# EAGLE design en76-timbremod (EAGLE 6.6.0)
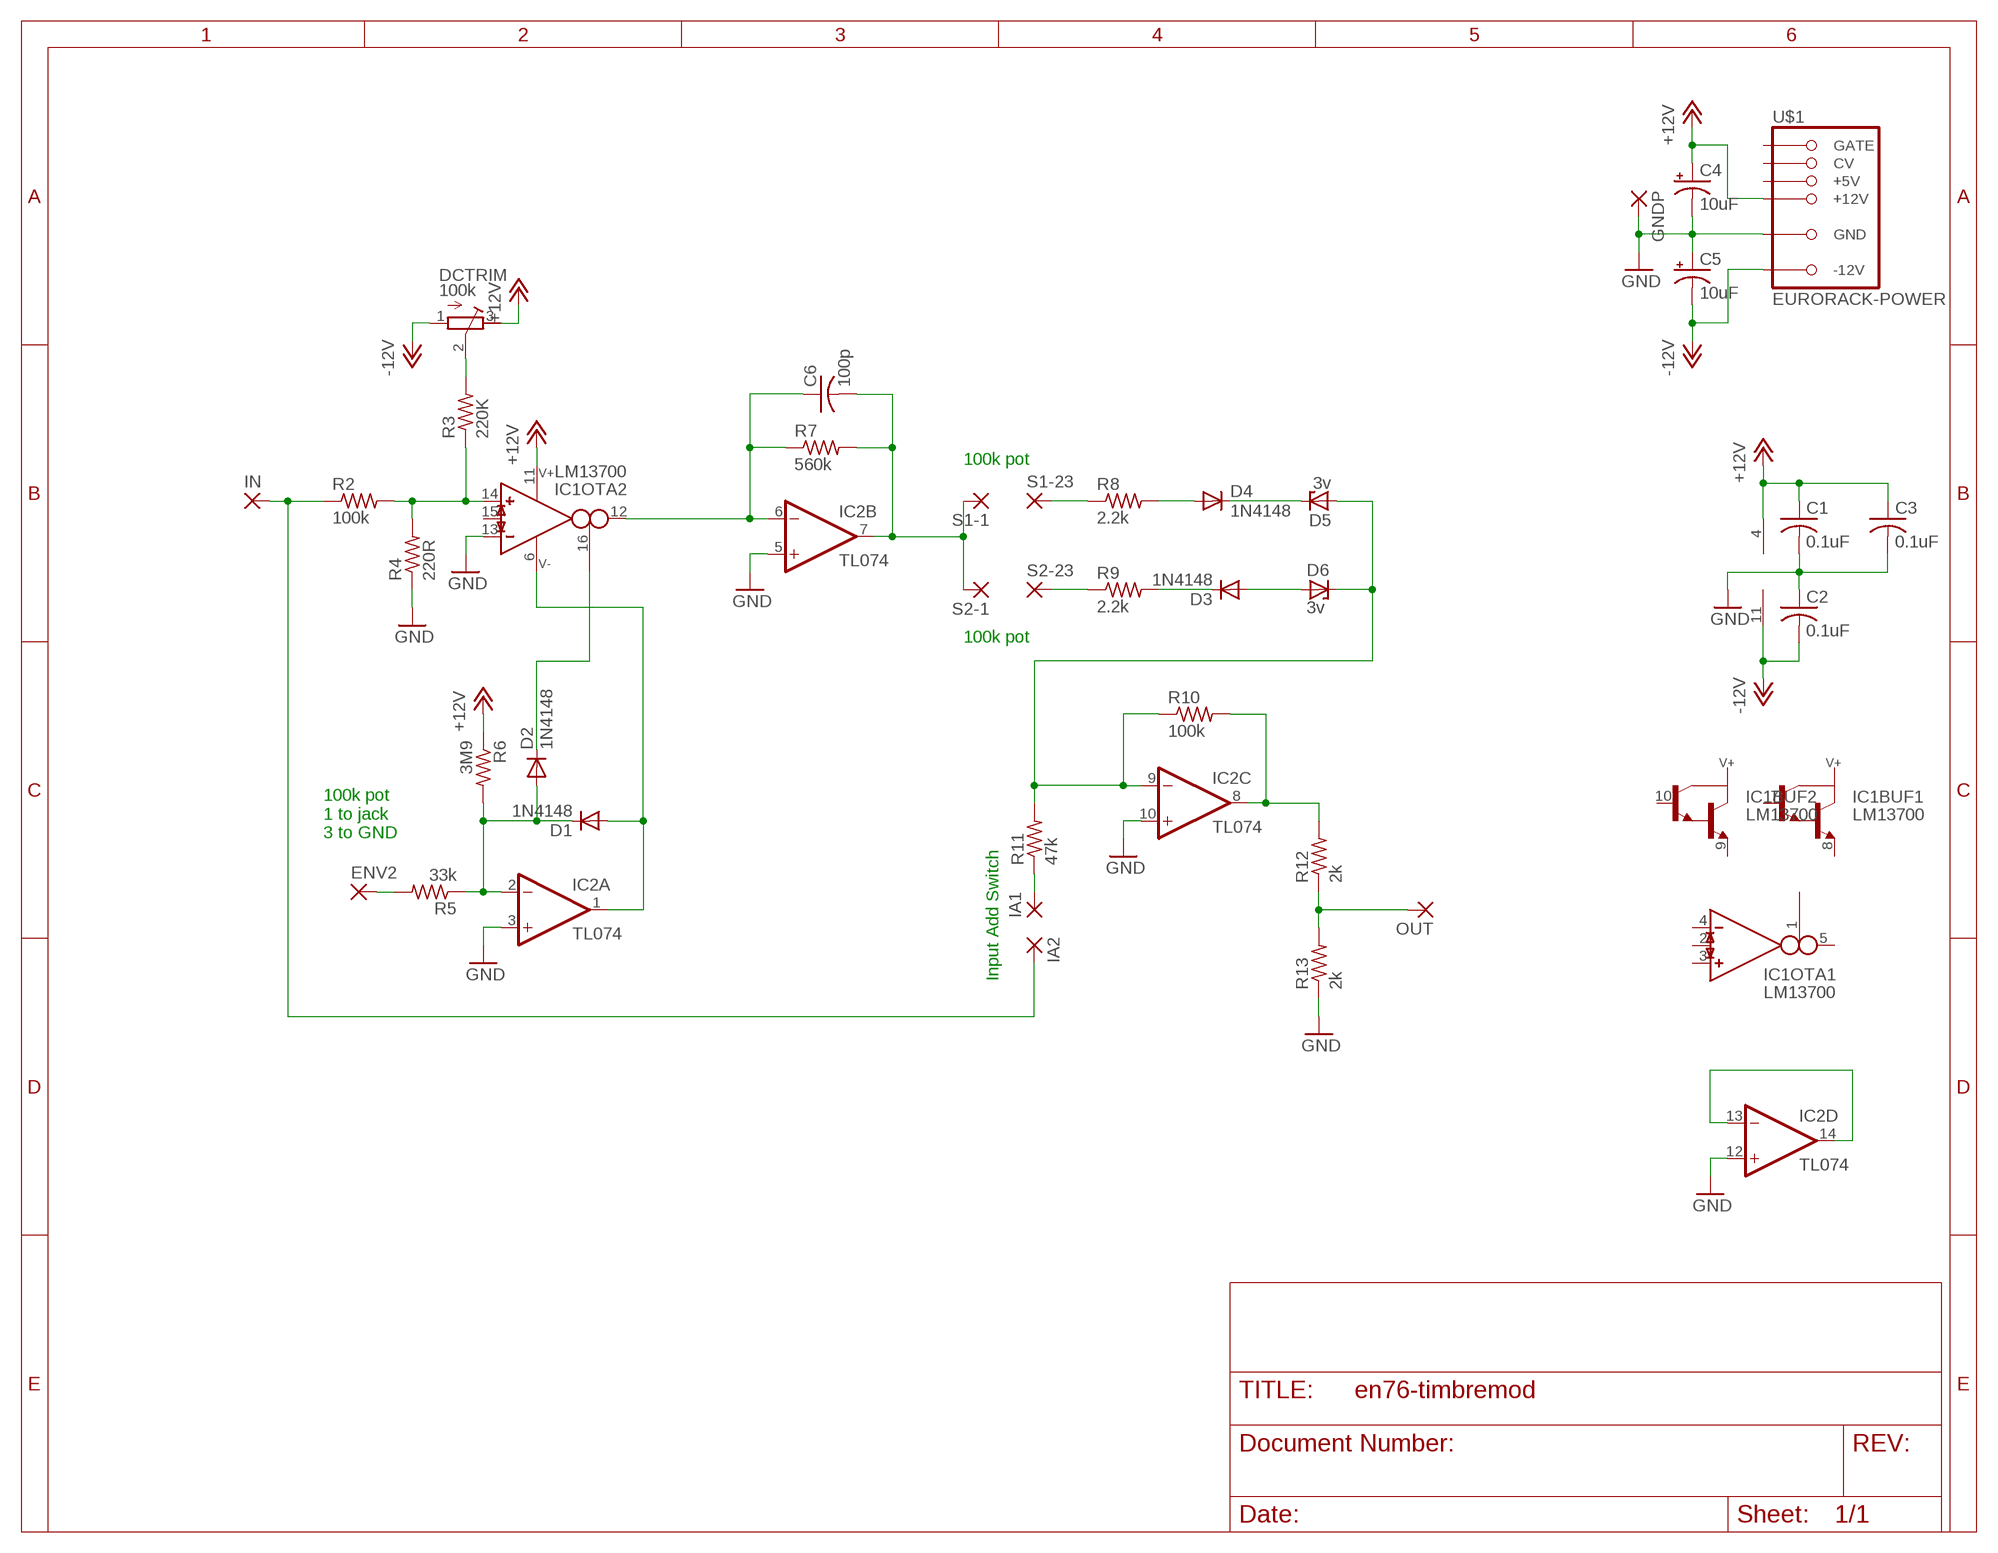
[diagram p0: schematic, sheet 1]

## Parts
C1  0.1uF  C-US050-025X075  [C050-025X075]
C2  0.1uF  C-US050-025X075  [C050-025X075]
C3  0.1uF  C-US050-025X075  [C050-025X075]
C4  10uF  CPOL-USE2.5-5  [E2,5-5]
C5  10uF  CPOL-USE2.5-5  [E2,5-5]
C6  100p  C-US050-025X075  [C050-025X075]
D1  1N4148  1N4148DO35-7  [DO35-7]
D2  1N4148  1N4148DO35-7  [DO35-7]
D3  1N4148  1N4148DO35-7  [DO35-7]
D4  1N4148  1N4148DO35-7  [DO35-7]
D5  3v  ZENER-DIODEDO35Z10  [DO35Z10]
D6  3v  ZENER-DIODEDO35Z10  [DO35Z10]
DCTRIM  100k  R-TRIMM64W  [RTRIM64W]
ENV2  2,54/1,0  [2,54/1,0]
GNDP  2,54/1,0  [2,54/1,0]
IA1  2,54/1,0  [2,54/1,0]
IA2  2,54/1,0  [2,54/1,0]
IC1  LM13700  LM13700-TOPDIP16  [DIL16]
IC2  TL074  TL074-TOPP  [DIL14]
IN  2,54/1,0  [2,54/1,0]
OUT  2,54/1,0  [2,54/1,0]
R2  100k  R-US_0207/10  [0207/10]
R3  220K  R-US_0207/10  [0207/10]
R4  220R  R-US_0207/10  [0207/10]
R5  33k  R-US_0207/10  [0207/10]
R6  3M9  R-US_0207/10  [0207/10]
R7  560k  R-US_0207/10  [0207/10]
R8  2.2k  R-US_0207/10  [0207/10]
R9  2.2k  R-US_0207/10  [0207/10]
R10  100k  R-US_0207/10  [0207/10]
R11  47k  R-US_0207/10  [0207/10]
R12  2k  R-US_0207/10  [0207/10]
R13  2k  R-US_0207/10  [0207/10]
S1-1  2,54/1,0  [2,54/1,0]
S1-23  2,54/1,0  [2,54/1,0]
S2-1  2,54/1,0  [2,54/1,0]
S2-23  2,54/1,0  [2,54/1,0]
U$1  EURORACK-POWER  [PINSHRD_PTH_2X8]

## Nets
+12V: C1.1 C3.1 C4.+ DCTRIM.3(E) IC1.11 IC2.4(P:V+) R6.1 U$1.+12V@1(+12V) U$1.+12V@2(+12V)
-12V: C2.2 C5.- DCTRIM.1(A) IC2.11(P:V-) U$1.-12V@1(-12V) U$1.-12V@2(-12V)
GND: C1.2 C2.1 C3.2 C4.- C5.+ GNDP.1(P) IC1.13(OTA2:IN_N) IC2.3(A:+IN) IC2.5(B:+IN) IC2.10(C:+IN) IC2.12(D:+IN) R4.1 R13.1 U$1.GND@1(GND) U$1.GND@2(GND) U$1.GND@3(GND) U$1.GND@4(GND) U$1.GND@5(GND) U$1.GND@6(GND)
N$1: IA2.1(P) IN.1(P) R2.1
N$2: IC1.14(OTA2:IN_P) R2.2 R3.1 R4.2
N$3: DCTRIM.2(S) R3.2
N$4: ENV2.1(P) R5.2
N$5: D1.C D2.A IC2.2(A:-IN) R5.1 R6.2
N$6: D1.A IC1.6 IC2.1(A:OUT)
N$7: D2.C IC1.16(OTA2:I_BIAS)
N$8: C6.1 IC1.12(OTA2:OUT) IC2.6(B:-IN) R7.1
N$9: C6.2 IC2.7(B:OUT) R7.2 S1-1.1(P) S2-1.1(P)
N$10: D4.A R8.2
N$11: D3.C R9.2
N$12: D4.C D5.C
N$13: D3.A D6.A
N$14: R8.1 S1-23.1(P)
N$15: D5.A D6.C IC2.9(C:-IN) R10.1 R11.2
N$16: R9.1 S2-23.1(P)
N$17: IA1.1(P) R11.1
N$19: IC2.8(C:OUT) R10.2 R12.2
N$20: OUT.1(P) R12.1 R13.2
N$21: IC2.13(D:-IN) IC2.14(D:OUT)
Unconnected: IC1.1(OTA1:I_BIAS) IC1.2(OTA1:I_DIODE) IC1.3(OTA1:IN_P) IC1.4(OTA1:IN_N) IC1.5(OTA1:OUT) IC1.7(BUF1:B) IC1.8(BUF1:E) IC1.9(BUF2:E) IC1.10(BUF2:B) IC1.15(OTA2:I_DIODE) U$1.+5V@1(+5V) U$1.+5V@2(+5V) U$1.CV@1(CV) U$1.CV@2(CV) U$1.GATE@1(GATE) U$1.GATE@2(GATE)

## Notes on the sheet
- 100k pot
- 100k pot
- 100k pot
  1 to jack
  3 to GND
- Input Add Switch

## Library data of the parts
C1-C3 C6 = rcl:C-US: CAPACITOR, American symbol
C4 C5 = rcl:CPOL-US: POLARIZED CAPACITOR, American symbol
D1-D4 = diode:1N4148: DIODE high speed (Philips)
D5 D6 = diode:ZENER-DIODE: Z-Diode
DCTRIM = rcl:R-TRIMM: Trimm resistor
ENV2 GNDP IA1 IA2 IN OUT S1-1 S1-23 S2-1 S2-23 = wirepad:2,54/1,0: THROUGH-HOLE PAD
IC1 = mmoretti:LM13700-TOP
IC2 = mmoretti:TL074-TOP: OP AMP
R2-R13 = rcl:R-US_: RESISTOR, American symbol
U$1 = mmoretti:EURORACK-POWER

## Board
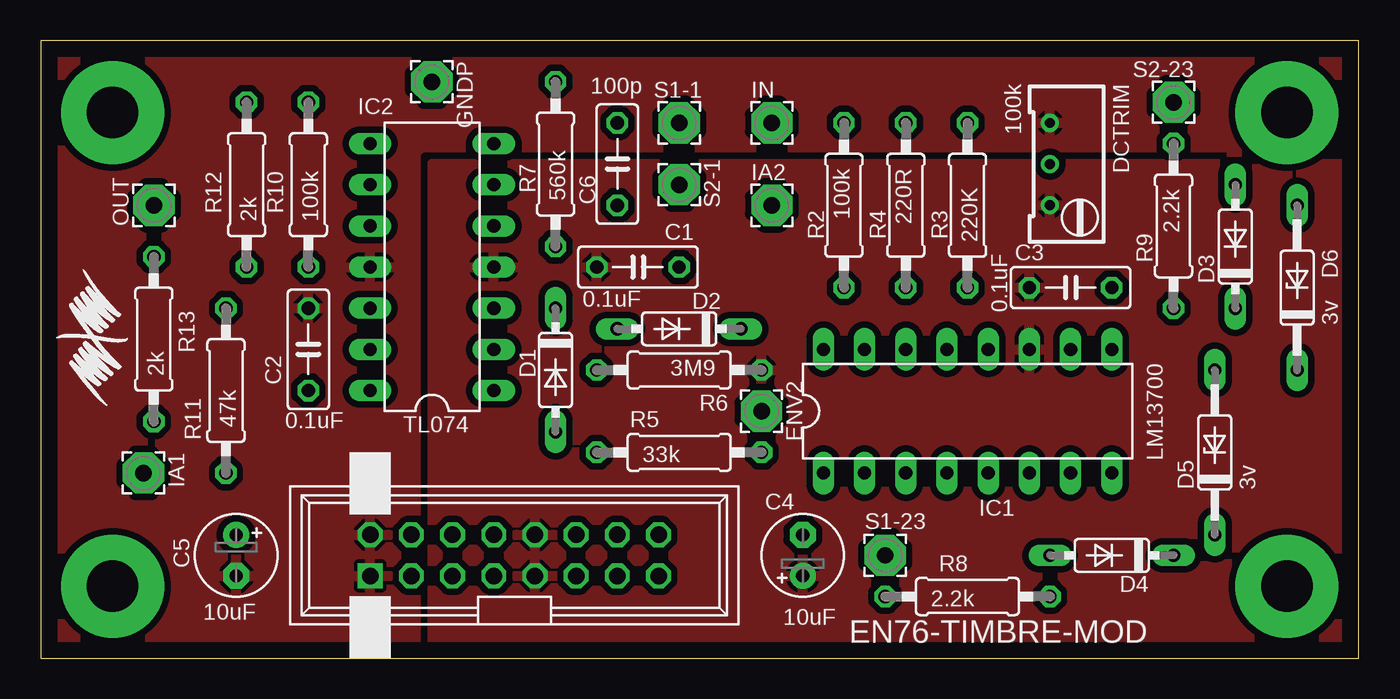
[diagram p1: board, top side]
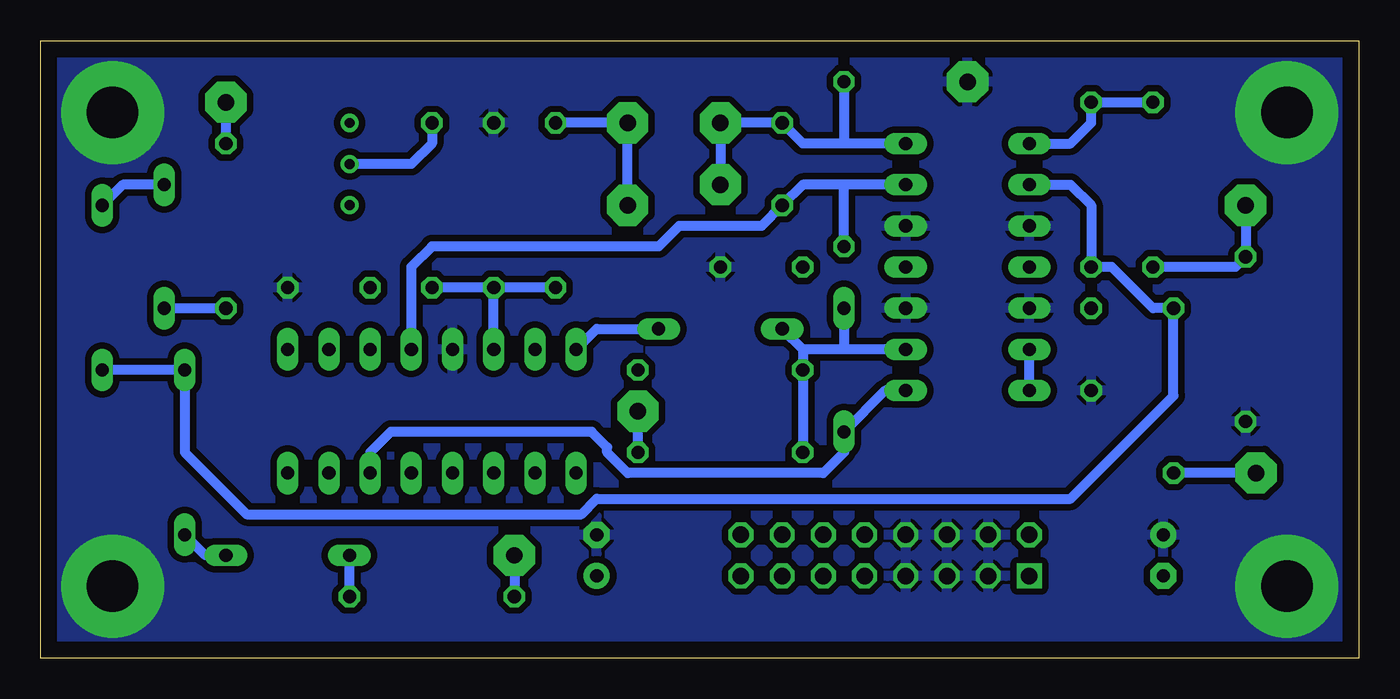
[diagram p2: board, bottom side, seen from below]

Size 81.28 x 38.1 mm. Coordinates in mm from the lower left corner, seen from the top.
Outline: 0,38.1 0,0 81.28,0 81.28,38.1 0,38.1
Copper layers (1*16): Top 0.035mm / dielectric 1.5mm / Bottom 0.035mm
Design rules "default": minimum track width 10mil, minimum drill 24mil, track to track 8mil, track to pad 8mil, pad to pad 8mil, via to via 8mil, smd to smd 8mil, copper to edge 40mil, drill to drill 8mil, minimum pad ring 10mil, minimum via ring 8mil, stop-mask expansion 4mil, vias tented up to drill 0mil, thermal gap 10mil

### Footprints (pad centres in the part's own frame; a part is rotated, then mirrored left to right if it is on the bottom)
C050-025X075 = drill 0.813 octagon: 1 -2.54,0; 2 2.54,0
E2,5-5 = drill 0.813 pad 1.6: + -1.27,0 | drill 0.813 pad 1.6 octagon: - 1.27,0
DO35-7 = drill 0.813 long: A 3.81,0; C -3.81,0
DO35Z10 = drill 0.813 long: A 5.08,0; C -5.08,0
RTRIM64W = drill 0.61: 1 1.27,-2.54; 2 1.27,0; 3 1.27,2.54
2,54/1,0 = drill 1.016 pad 2.54 octagon: 1 0,0
DIL16 = drill 0.813 long: 1 -8.89,-3.81; 2 -6.35,-3.81; 3 -3.81,-3.81; 4 -1.27,-3.81; 5 1.27,-3.81; 6 3.81,-3.81; 7 6.35,-3.81; 8 8.89,-3.81; 9 8.89,3.81; 10 6.35,3.81; 11 3.81,3.81; 12 1.27,3.81; 13 -1.27,3.81; 14 -3.81,3.81; 15 -6.35,3.81; 16 -8.89,3.81
DIL14 = drill 0.813 long: 1 -7.62,-3.81; 2 -5.08,-3.81; 3 -2.54,-3.81; 4 0,-3.81; 5 2.54,-3.81; 6 5.08,-3.81; 7 7.62,-3.81; 8 7.62,3.81; 9 5.08,3.81; 10 2.54,3.81; 11 0,3.81; 12 -2.54,3.81; 13 -5.08,3.81; 14 -7.62,3.81
0207/10 = drill 0.813 octagon: 1 -5.08,0; 2 5.08,0
PINSHRD_PTH_2X8 = drill 1.016 octagon: +5V@1 3.81,1.27; +5V@2 3.81,-1.27; +12V@1 1.27,1.27; +12V@2 1.27,-1.27; -12V@1 -8.89,1.27; CV@1 6.35,1.27; CV@2 6.35,-1.27; GATE@1 8.89,1.27; GATE@2 8.89,-1.27; GND@1 -6.35,1.27; GND@2 -6.35,-1.27; GND@3 -3.81,1.27; GND@4 -3.81,-1.27; GND@5 -1.27,1.27; GND@6 -1.27,-1.27 | drill 1.016 square: -12V@2 -8.89,-1.27

### Placement (x,y rotation side)
C1  36.83,24.13 0 top
C2  16.51,19.05 90 top
C3  63.5,22.86 0 top
C4  46.99,6.35 90 top
C5  12.06,6.35 270 top
C6  35.56,30.48 90 top
D1  31.75,17.78 270 top
D2  39.37,20.32 180 top
D3  73.66,25.4 90 top
D4  66.04,6.35 180 top
D5  72.39,12.7 90 top
D6  77.47,22.86 90 top
DCTRIM  63.5,30.48 180 top
ENV2  44.45,15.24 270 top
GNDP  24.13,35.56 270 top
IA1  6.35,11.43 270 top
IA2  45.09,27.94 0 top
IC1  57.15,15.24 0 top
IC2  24.13,24.13 90 top
IN  45.09,33.02 0 top
OUT  6.99,27.94 270 top
R2  49.53,27.94 270 top
R3  57.15,27.94 90 top
R4  53.34,27.94 270 top
R5  39.37,12.7 0 top
R6  39.37,17.78 180 top
R7  31.75,30.48 90 top
R8  57.15,3.81 0 top
R9  69.85,26.67 270 top
R10  16.51,29.21 90 top
R11  11.43,16.51 90 top
R12  12.7,29.21 90 top
R13  6.99,19.68 90 top
S1-1  39.37,33.02 270 top
S1-23  52.07,6.35 180 top
S2-1  39.37,29.21 270 top
S2-23  69.85,34.29 0 top
U$1  29.21,6.35 0 top

### Tracks (layer width: path | path; a pad name or v marks a point on that pad's centre or on a via)
+12V
  pour Top (isolate 0.406): 26.67,0 81.28,0 81.28,30.48 24.13,30.48 24.13,0
-12V
  pour Top (isolate 0.406, rank 2): 24.13,0 0,0 0,38.1 81.28,38.1 81.28,30.48 24.13,30.48
GND  (via drill 3.17 pad 6.35)
  other vias: 4.45,33.66 76.83,33.66 4.45,4.45 76.83,4.45
  pour Bottom (isolate 0.406): 0,38.1 81.28,38.1 81.28,0 0,0
N$1
  Bottom 0.61: IA2.1 IN.1 R2.1
N$2
  Bottom 0.61: R2.2 R4.2 | R4.2 R3.1 | IC1.14 R4.2
N$3
  Bottom 0.61: R3.2 57.15,31.75 58.42,30.48 DCTRIM.2
N$4
  Bottom 0.61: R5.2 ENV2.1
N$5
  Bottom 0.61: IC2.2 31.75,19.05 | 31.75,19.05 34.29,19.05 | 34.29,19.05 R6.2 R5.1 | D1.C 31.75,19.05 | D2.A 34.29,19.05
N$6
  Bottom 0.61: IC2.1 29.21,16.51 D1.A 31.75,12.7 33.02,11.43 45.09,11.43 46.35,12.7 46.35,13.02 47.31,13.97 59.69,13.97 60.96,12.7 IC1.6
N$7
  Bottom 0.61: IC1.16 46.99,20.32 D2.C
N$8
  Bottom 0.61: IC2.6 31.75,29.21 | 31.75,29.21 34.29,29.21 C6.1 36.83,26.67 41.91,26.67 43.18,25.4 57.15,25.4 58.42,24.13 IC1.12 | R7.1 31.75,29.21
N$9
  Bottom 0.61: IC2.7 31.75,31.75 | 31.75,31.75 34.29,31.75 C6.2 S1-1.1 S2-1.1 | R7.2 31.75,31.75
N$10
  Bottom 0.61: R8.2 D4.A
N$11
  Bottom 0.61: D3.C R9.2
N$12
  Bottom 0.61: D4.C 71.12,6.35 D5.C
N$13
  Bottom 0.61: D3.A 76.2,29.21 D6.A
N$14
  Bottom 0.61: S1-23.1 R8.1
N$15
  Bottom 0.61: D6.C D5.A 72.39,12.7 68.58,8.89 47.94,8.89 46.99,9.84 17.78,9.84 11.43,16.19 R11.2 12.7,21.59 15.24,24.13 R10.1 16.51,27.94 17.78,29.21 IC2.9
N$16
  Bottom 0.61: R9.1 S2-23.1
N$17
  Bottom 0.61: IA1.1 R11.1
N$19
  Bottom 0.61: IC2.8 17.78,31.75 16.51,33.02 R10.2 R12.2
N$20
  Bottom 0.61: OUT.1 R13.2 7.62,24.13 R12.1
N$21
  Bottom 0.61: IC2.14 IC2.13

### Text on the board
tPlace: EN76-TIMBRE-MOD